# EAGLE schematic Ulimate (EAGLE 7.2.0)
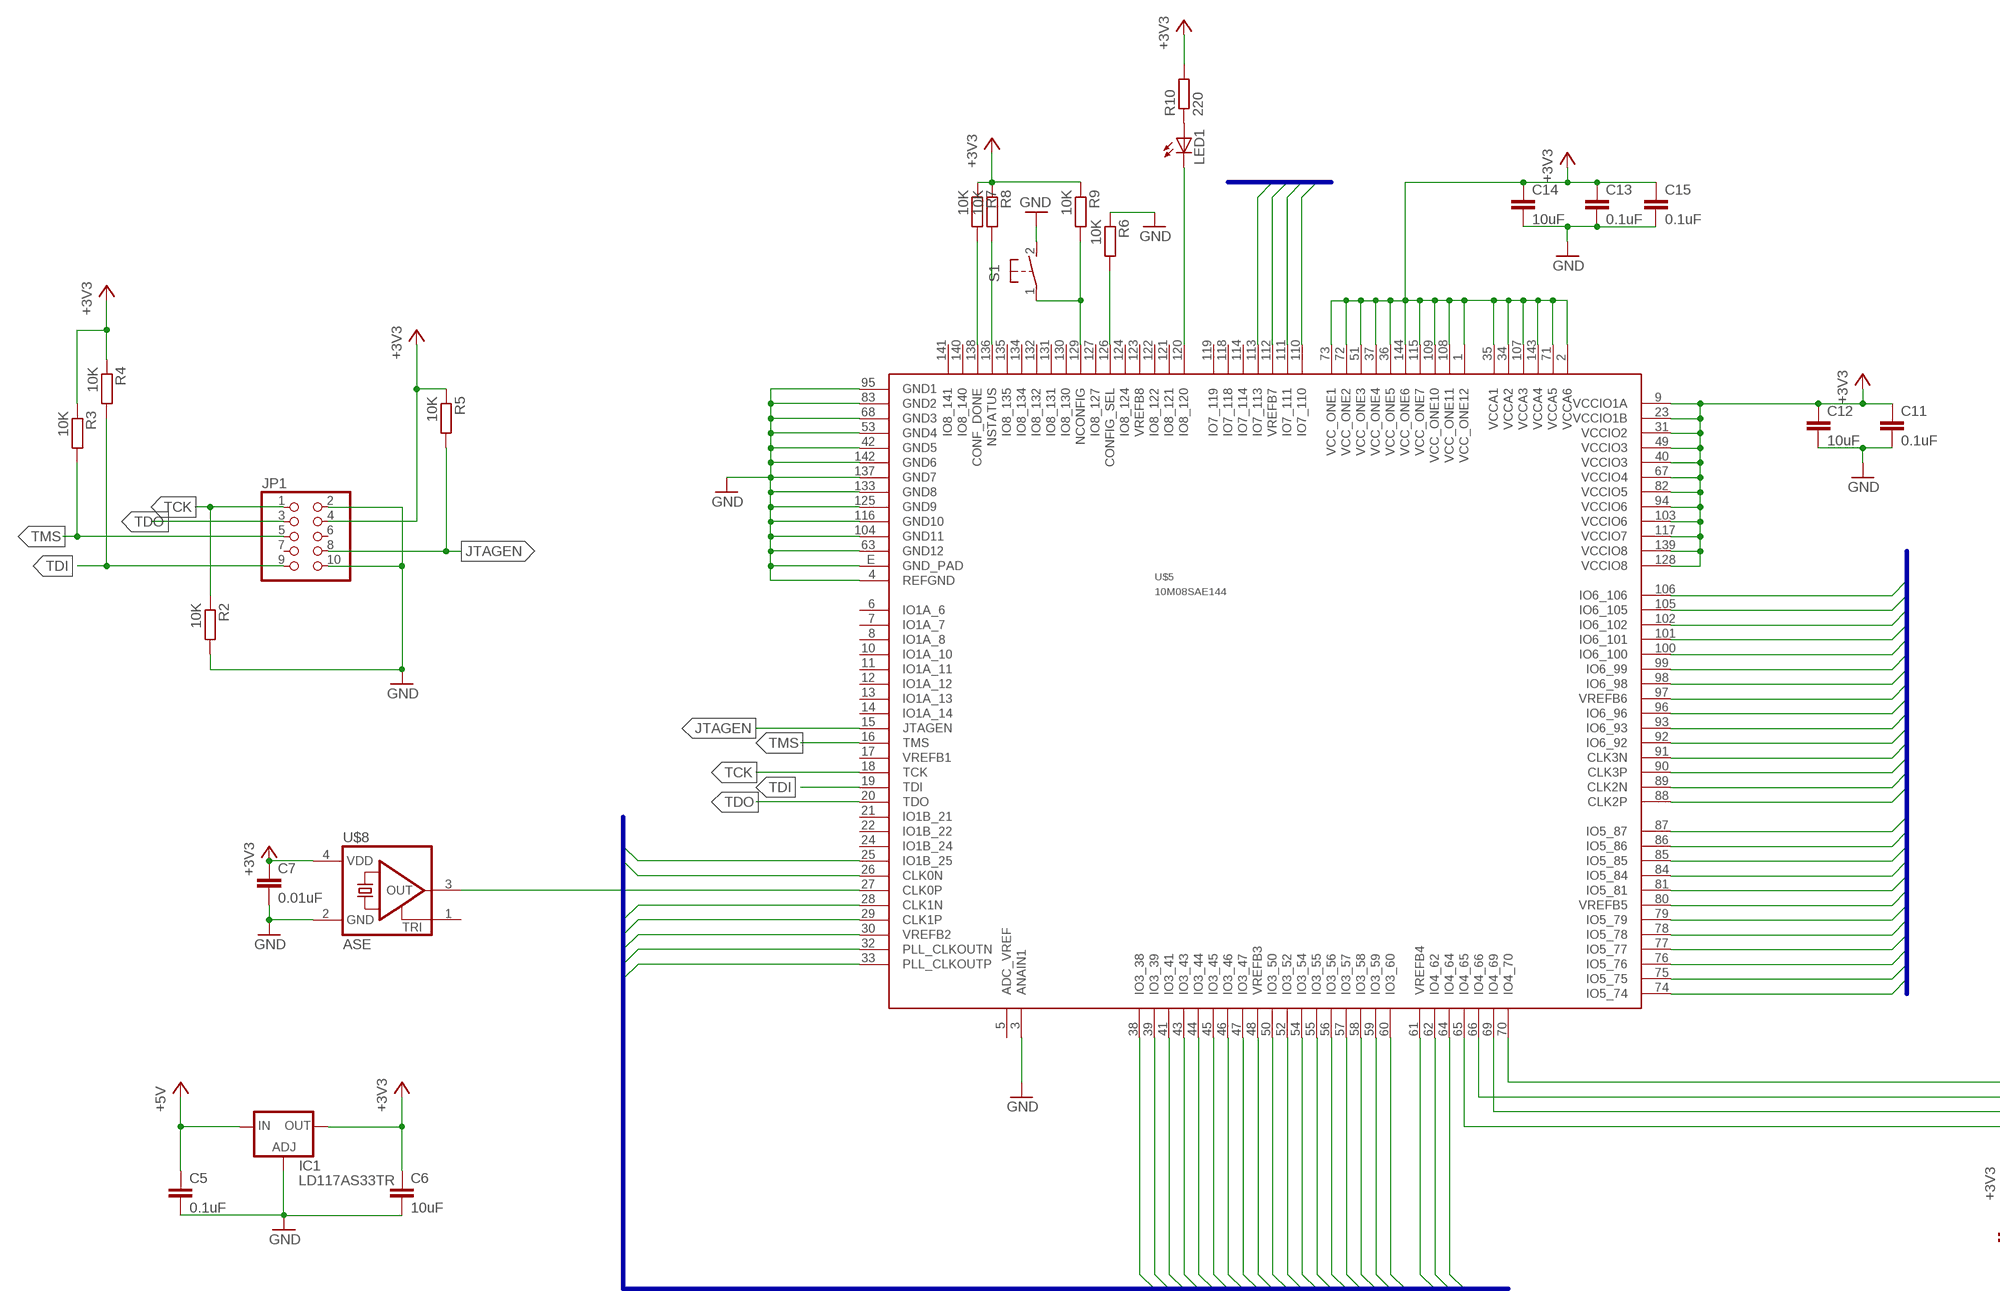
[diagram p0: schematic, sheet 1, part 1 of 2]
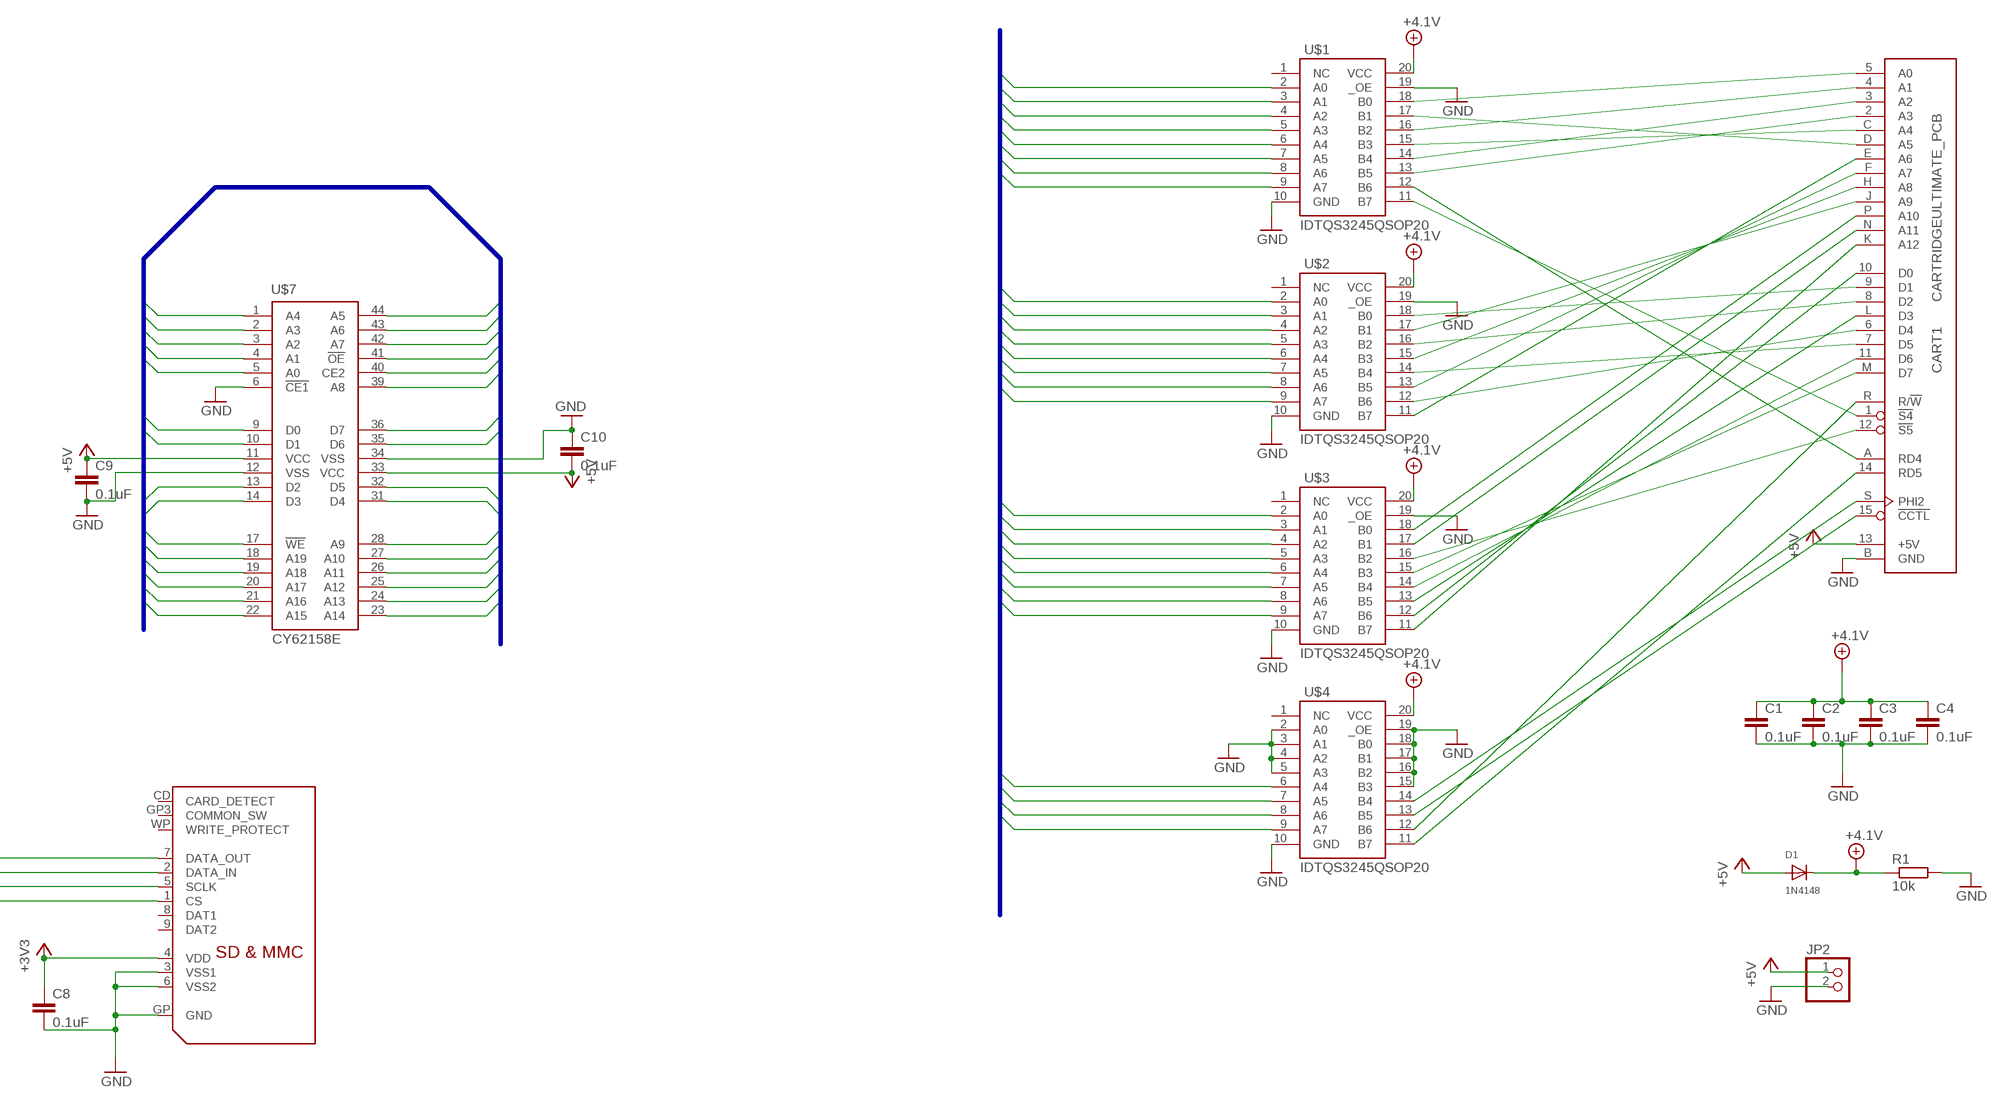
[diagram p1: schematic, sheet 1, part 2 of 2]

## Parts
C1  0.1uF  C-EUC0805K  [C0805K]
C2  0.1uF  C-EUC0805K  [C0805K]
C3  0.1uF  C-EUC0805K  [C0805K]
C4  0.1uF  C-EUC0805K  [C0805K]
C5  0.1uF  C-EUC0805K  [C0805K]
C6  10uF  C-EUC0805K  [C0805K]
C7  0.01uF  C-EUC0805K  [C0805K]
C8  0.1uF  C-EUC0805K  [C0805K]
C9  0.1uF  C-EUC0805K  [C0805K]
C10  0.1uF  C-EUC0805K  [C0805K]
C11  0.1uF  C-EUC0805K  [C0805K]
C12  10uF  C-EUC0805K  [C0805K]
C13  0.1uF  C-EUC0805K  [C0805K]
C14  10uF  C-EUC0805K  [C0805K]
C15  0.1uF  C-EUC0805K  [C0805K]
CART1  CARTRIDGEULTIMATE_PCB  [CART_ULTIMATE]
D1  1N4148  DIODE_SOD-123FL  [SOD-123FL]
IC1  LD117AS33TR  [SOT223]
JP1  PINHD-2X5  [2X05]
JP2  PINHD-1X2  [1X02]
LED1  LEDSML0805  [SML0805]
R1  10k  R-EU_R0805  [R0805]
R2  10K  R-EU_R0805  [R0805]
R3  10K  R-EU_R0805  [R0805]
R4  10K  R-EU_R0805  [R0805]
R5  10K  R-EU_R0805  [R0805]
R6  10K  R-EU_R0805  [R0805]
R7  10K  R-EU_R0805  [R0805]
R8  10K  R-EU_R0805  [R0805]
R9  10K  R-EU_R0805  [R0805]
R10  220  R-EU_R0805  [R0805]
S1  31-XXSKINNY  [B3F-31XX-SKINNIER]
U$1  IDTQS3245QSOP20  [QSOP20]
U$2  IDTQS3245QSOP20  [QSOP20]
U$3  IDTQS3245QSOP20  [QSOP20]
U$4  IDTQS3245QSOP20  [QSOP20]
U$5  10M08SAE144  [EQFP144]
U$6  SDMMC06132  [06132]
U$7  CY62158E  [TSOP44-II]
U$8  ASE  [ASE]

## Nets
!OE: U$5.106(IO6_106) U$7.41(!OE)
!WE: U$5.89(CLK2N) U$7.17(!WE)
+3V3: C6.1 C7.1 C8.1 C11.1 C12.1 C13.1 C14.1 C15.1 IC1.4(OUT) JP1.4 R3.1 R4.1 R5.1 R7.1 R8.1 R9.1 R10.2 U$5.1(VCC_ONE12) U$5.2(VCCA6) U$5.9(VCCIO1A) U$5.23(VCCIO1B) U$5.31(VCCIO2) U$5.34(VCCA2) U$5.35(VCCA1) U$5.36(VCC_ONE5) U$5.37(VCC_ONE4) U$5.40(VCCIO3) U$5.49(VCCIO3) U$5.51(VCC_ONE3) U$5.67(VCCIO4) U$5.71(VCCA5) U$5.72(VCC_ONE2) U$5.73(VCC_ONE1) U$5.82(VCCIO5) U$5.94(VCCIO6) U$5.103(VCCIO6) U$5.107(VCCA3) U$5.108(VCC_ONE11) U$5.109(VCC_ONE10) U$5.115(VCC_ONE7) U$5.117(VCCIO7) U$5.128(VCCIO8) U$5.139(VCCIO8) U$5.143(VCCA4) U$5.144(VCC_ONE6) U$6.4(VDD) U$8.4(VDD)
+4.1V: C1.1 C2.1 C3.1 C4.1 D1.C R1.1 U$1.20(VCC) U$2.20(VCC) U$3.20(VCC) U$4.20(VCC)
+5V: C5.1 C9.1 C10.2 CART1.13(+5V) D1.A IC1.3(IN) JP2.1 U$7.11(VCC) U$7.33(VCC)
A0: U$5.96(IO6_96) U$7.5(A0)
A1: U$5.97(VREFB6) U$7.4(A1)
A2: U$5.98(IO6_98) U$7.3(A2)
A3: U$5.99(IO6_99) U$7.2(A3)
A4: U$5.100(IO6_100) U$7.1(A4)
A5: U$5.105(IO6_105) U$7.44(A5)
A6: U$5.102(IO6_102) U$7.43(A6)
A7: U$5.101(IO6_101) U$7.42(A7)
A8: U$5.111(IO7_111) U$7.39(A8)
A9: U$5.76(IO5_76) U$7.28(A9)
A10: U$5.77(IO5_77) U$7.27(A10)
A11: U$5.78(IO5_78) U$7.26(A11)
A12: U$5.79(IO5_79) U$7.25(A12)
A13: U$5.80(VREFB5) U$7.24(A13)
A14: U$5.81(IO5_81) U$7.23(A14)
A15: U$5.84(IO5_84) U$7.22(A15)
A16: U$5.85(IO5_85) U$7.21(A16)
A17: U$5.86(IO5_86) U$7.20(A17)
A18: U$5.87(IO5_87) U$7.19(A18)
A19: U$5.88(CLK2P) U$7.18(A19)
CART_A0: U$1.2(A0) U$5.39(IO3_39)
CART_A1: U$1.4(A2) U$5.33(PLL_CLKOUTP)
CART_A2: U$1.6(A4) U$5.30(VREFB2)
CART_A3: U$1.7(A5) U$5.29(CLK1P)
CART_A4: U$1.5(A3) U$5.32(PLL_CLKOUTN)
CART_A5: U$1.3(A1) U$5.38(IO3_38)
CART_A6: U$2.9(A7) U$5.41(IO3_41)
CART_A7: U$2.7(A5) U$5.44(IO3_44)
CART_A8: U$2.5(A3) U$5.46(IO3_46)
CART_A9: U$2.3(A1) U$5.48(VREFB3)
CART_A10: U$3.2(A0) U$5.60(IO3_60)
CART_A11: U$3.3(A1) U$5.59(IO3_59)
CART_A12: U$3.9(A7) U$5.52(IO3_52)
CART_CTL: U$4.7(A5) U$5.64(IO4_64)
CART_D0: U$3.8(A6) U$5.54(IO3_54)
CART_D1: U$2.2(A0) U$5.50(IO3_50)
CART_D2: U$2.4(A2) U$5.47(IO3_47)
CART_D3: U$3.7(A5) U$5.55(IO3_55)
CART_D4: U$2.8(A6) U$5.43(IO3_43)
CART_D5: U$2.6(A4) U$5.45(IO3_45)
CART_D6: U$3.6(A4) U$5.56(IO3_56)
CART_D7: U$3.5(A3) U$5.57(IO3_57)
CART_PHI: U$4.6(A4) U$5.26(CLK0N)
CART_RD4: U$1.8(A6) U$5.25(IO1B_25)
CART_RD5: U$4.9(A7) U$5.61(VREFB4)
CART_RW: U$4.8(A6) U$5.62(IO4_62)
CART_S4: U$1.9(A7) U$5.28(CLK1N)
CART_S5: U$3.4(A2) U$5.58(IO3_58)
CE: U$5.110(IO7_110) U$7.40(CE2)
D0: U$5.93(IO6_93) U$7.9(D0)
D1: U$5.92(IO6_92) U$7.10(D1)
D2: U$5.91(CLK3N) U$7.13(D2)
D3: U$5.90(CLK3P) U$7.14(D3)
D4: U$5.75(IO5_75) U$7.31(D4)
D5: U$5.74(IO5_74) U$7.32(D5)
D6: U$5.113(IO7_113) U$7.35(D6)
D7: U$5.112(VREFB7) U$7.36(D7)
GND: C1.2 C2.2 C3.2 C4.2 C5.2 C6.2 C7.2 C8.2 C9.2 C10.1 C11.2 C12.2 C13.2 C14.2 C15.2 CART1.B(GND) IC1.1(ADJ) JP1.2 JP1.10 JP2.2 R1.2 R2.2 R6.1 S1.2(S) U$1.10(GND) U$1.19(_OE) U$2.10(GND) U$2.19(_OE) U$3.10(GND) U$3.19(_OE) U$4.2(A0) U$4.3(A1) U$4.4(A2) U$4.5(A3) U$4.10(GND) U$4.15(B3) U$4.16(B2) U$4.17(B1) U$4.18(B0) U$4.19(_OE) U$5.3(ANAIN1) U$5.4(REFGND) U$5.42(GND5) U$5.53(GND4) U$5.63(GND12) U$5.68(GND3) U$5.83(GND2) U$5.95(GND1) U$5.104(GND11) U$5.116(GND10) U$5.125(GND9) U$5.133(GND8) U$5.137(GND7) U$5.142(GND6) U$5.E(GND_PAD) U$6.3(VSS1) U$6.6(VSS2) U$6.GP(GND) U$7.6(!CE1) U$7.12(VSS) U$7.34(VSS) U$8.2(GND)
JTAGEN: JP1.8 R5.2 U$5.15(JTAGEN)
N$1: CART1.1(!S4) U$1.11(B7)
N$2: CART1.A(RD4) U$1.12(B6)
N$3: CART1.2(A3) U$1.13(B5)
N$4: CART1.3(A2) U$1.14(B4)
N$5: CART1.C(A4) U$1.15(B3)
N$6: CART1.4(A1) U$1.16(B2)
N$7: CART1.D(A5) U$1.17(B1)
N$8: CART1.5(A0) U$1.18(B0)
N$9: CART1.E(A6) U$2.11(B7)
N$10: CART1.6(D4) U$2.12(B6)
N$11: CART1.F(A7) U$2.13(B5)
N$12: CART1.7(D5) U$2.14(B4)
N$13: CART1.H(A8) U$2.15(B3)
N$14: CART1.8(D2) U$2.16(B2)
N$15: CART1.J(A9) U$2.17(B1)
N$16: CART1.9(D1) U$2.18(B0)
N$17: CART1.K(A12) U$3.11(B7)
N$18: CART1.10(D0) U$3.12(B6)
N$19: CART1.L(D3) U$3.13(B5)
N$20: CART1.11(D6) U$3.14(B4)
N$21: CART1.M(D7) U$3.15(B3)
N$22: CART1.12(!S5) U$3.16(B2)
N$23: CART1.N(A11) U$3.17(B1)
N$24: CART1.P(A10) U$3.18(B0)
N$25: CART1.14(RD5) U$4.11(B7)
N$26: CART1.R(R/!W) U$4.12(B6)
N$27: CART1.15(!CCTL) U$4.13(B5)
N$28: CART1.S(PHI2) U$4.14(B4)
N$29: U$5.27(CLK0P) U$8.3(OUT)
N$30: R6.2 U$5.126(CONFIG_SEL)
N$31: R7.2 U$5.138(CONF_DONE)
N$32: R8.2 U$5.136(NSTATUS)
N$33: R9.2 S1.1(P) U$5.129(NCONFIG)
N$34: LED1.A R10.1
N$35: LED1.C U$5.120(IO8_120)
SD_CLK: U$5.69(IO4_69) U$6.5(SCLK)
SD_CS: U$5.65(IO4_65) U$6.1(CS)
SD_DI: U$5.66(IO4_66) U$6.2(DATA_IN)
SD_DO: U$5.70(IO4_70) U$6.7(DATA_OUT)
TCK: JP1.1 R2.1 U$5.18(TCK)
TDI: JP1.9 R4.2 U$5.19(TDI)
TDO: JP1.3 U$5.20(TDO)
TMS: JP1.5 R3.2 U$5.16(TMS)
Unconnected: JP1.6 JP1.7 U$1.1(NC) U$2.1(NC) U$3.1(NC) U$4.1(NC) U$5.5(ADC_VREF) U$5.6(IO1A_6) U$5.7(IO1A_7) U$5.8(IO1A_8) U$5.10(IO1A_10) U$5.11(IO1A_11) U$5.12(IO1A_12) U$5.13(IO1A_13) U$5.14(IO1A_14) U$5.17(VREFB1) U$5.21(IO1B_21) U$5.22(IO1B_22) U$5.24(IO1B_24) U$5.114(IO7_114) U$5.118(IO7_118) U$5.119(IO7_119) U$5.121(IO8_121) U$5.122(IO8_122) U$5.123(VREFB8) U$5.124(IO8_124) U$5.127(IO8_127) U$5.130(IO8_130) U$5.131(IO8_131) U$5.132(IO8_132) U$5.134(IO8_134) U$5.135(IO8_135) U$5.140(IO8_140) U$5.141(IO8_141) U$6.8(DAT1) U$6.9(DAT2) U$6.CD(CARD_DETECT) U$6.GP3(COMMON_SW) U$6.WP(WRITE_PROTECT) U$8.1(TRI)

## Buses
CART_D[0..7],CART_A[0..12],CART_S4,CART_S5,CART_RD4,CART_RD5,CART_RW,CART_PHI,CART_CTL
D[0..7],A[0..19],CE,!WE,!OE

## Library data of the parts
C1-C15 = rcl:C-EU: CAPACITOR, European symbol
CART1 = eagle-6.5.0-atari:CARTRIDGE: Cartridge
D1 = adafruit:DIODE: Diode SMADIODE - SMA Surface Mount Package 20V 1A Schottky Diode Digikey: 641-1014-6-ND DO-1N4148 - Through Hole Small Current Diode SOD-123 20V 1 A (.5mV Vf) Schottky Diode - Digikey: MBRX120TPMSCT-ND SOD-323 10V 570mA (.38mV Vf, 3ns) Schottky Diode - Digikey: ZLLS410CT-ND SOD-523 30V 30mA Schottky Diode (RB751S-40TE61) - Digikey: RB751S-40TE61CT-ND SOT23-R/W - SOT23 Package (R = Solder Paste/Reflow Ovens, W = Hand-Soldering) BAT54Film 40V 300mA - Digikey: 497-7162-1-ND
IC1 = v-reg:LD117A?*: Low drop fixed and adjustable positive voltage regulators 1 A Source: http://www.st.com/stonline/products/literature/ds/7194/ld1117axx.pdf
JP1 = pinhead:PINHD-2X5: PIN HEADER
JP2 = pinhead:PINHD-1X2: PIN HEADER
LED1 = led:LED: LED OSRAM: - CHIPLED LG R971, LG N971, LY N971, LG Q971, LY Q971, LO R971, LY R971 LH N974, LH R974 LS Q976, LO Q976, LY Q976 LO Q996 - Hyper CHIPLED LW Q18S LB Q993, LB Q99A, LB R99A - SideLED LS A670, LO A670, LY A670, LG A670, LP A670 LB A673, LV A673, LT A673, LW A673 LH A674 LY A675 LS A676, LA A676, LO A676, LY A676, LW A676 LS A679, LY A679, LG A679 - Hyper Micro SIDELED® LS Y876, LA Y876, LO Y876, LY Y876 LT Y87S - SmartLED LW L88C, LW L88S LB L89C, LB L89S, LG L890 LS L89K, LO L89K, LY L89K LS L896, LA L896, LO L896, LY L896 - TOPLED LS T670, LO T670, LY T670, LG T670, LP T670 LSG T670, LSP T670, LSY T670, LOP T670, LYG T670 LG T671, LOG T671, LSG T671 LB T673, LV T673, LT T673, LW T673 LH T674 LS T676, LA T676, LO T676, LY T676, LB T676, LH T676, LSB T676, LW T676 LB T67C, LV T67C, LT T67C, LS T67K, LO T67K, LY T67K, LW E67C LS E67B, LA E67B, LO E67B, LY E67B, LB E67C, LV E67C, LT E67C LW T67C LS T679, LY T679, LG T679 LS T770, LO T770, LY T770, LG T770, LP T770 LB T773, LV T773, LT T773, LW T773 LH T774 LS E675, LA E675, LY E675, LS T675 LS T776, LA T776, LO T776, LY T776, LB T776 LHGB T686 LT T68C, LB T68C - Hyper Mini TOPLED® LB M676 - Mini TOPLED Santana® LG M470 LS M47K, LO M47K, LY M47K Source: http://www.osram.convergy.de LUXEON: - LUMILED® LXK2-PW12-R00, LXK2-PW12-S00, LXK2-PW14-U00, LXK2-PW14-V00 LXK2-PM12-R00, LXK2-PM12-S00, LXK2-PM14-U00 LXK2-PE12-Q00, LXK2-PE12-R00, LXK2-PE12-S00, LXK2-PE14-T00, LXK2-PE14-U00 LXK2-PB12-K00, LXK2-PB12-L00, LXK2-PB12-M00, LXK2-PB14-N00, LXK2-PB14-P00, LXK2-PB14-Q00 LXK2-PR12-L00, LXK2-PR12-M00, LXK2-PR14-Q00, LXK2-PR14-R00 LXK2-PD12-Q00, LXK2-PD12-R00, LXK2-PD12-S00 LXK2-PH12-R00, LXK2-PH12-S00 LXK2-PL12-P00, LXK2-PL12-Q00, LXK2-PL12-R00 Source: www.luxeon.com KINGBRIGHT: KA-3528ASYC Source: www.kingbright.com
R1-R10 = resistor:R-EU_: RESISTOR, European symbol
S1 = adafruit:31-XX: OMRON SWITCH Now with beefier pads!
U$1-U$4 = IDTQS_3245QG:IDTQS3245
U$5 = 10M08SAE144:10M08SAE144
U$6 = adafruit:SDMMC: SD MMC Card holder 4UCON part #06132 - easy to solder
U$7 = CY62158E:CY62158E
U$8 = crystal:ASE: 3.3Vdc CMOS SMD CRYSTAL CLOCK OSCILLATOR SOurce: www.abracon.com; OC_FARNELL: unknown; OC_NEWARK: unknown